# EAGLE design Delta Calc (EAGLE 9.3.0)
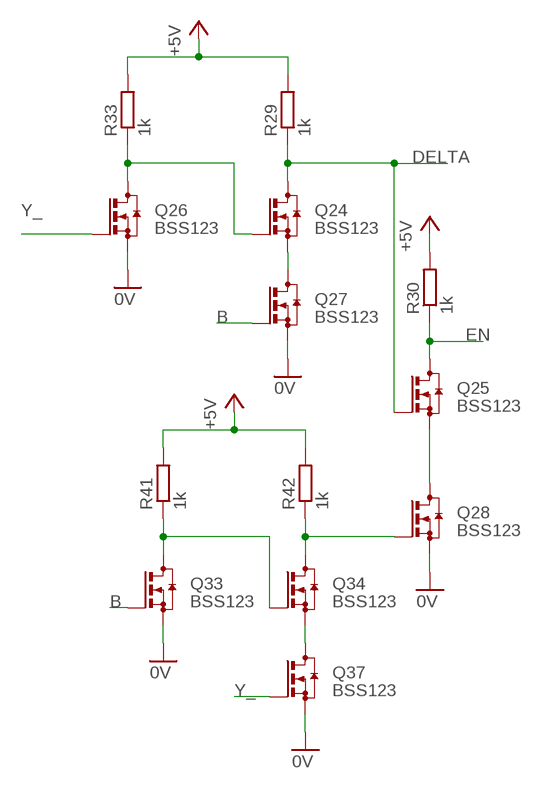
[diagram p0: schematic, sheet 1]

## Parts
Q24  BSS123  [SOT23]
Q25  BSS123  [SOT23]
Q26  BSS123  [SOT23]
Q27  BSS123  [SOT23]
Q28  BSS123  [SOT23]
Q33  BSS123  [SOT23]
Q34  BSS123  [SOT23]
Q37  BSS123  [SOT23]
R29  1k  R-EU_M0805  [M0805]
R30  1k  R-EU_M0805  [M0805]
R33  1k  R-EU_M0805  [M0805]
R41  1k  R-EU_M0805  [M0805]
R42  1k  R-EU_M0805  [M0805]

## Nets
0V: Q26.2(S) Q27.2(S) Q28.2(S) Q33.2(S) Q37.2(S)
+5V: R29.2 R30.2 R33.2 R41.2 R42.2
B: Q27.1(G) Q33.1(G)
DELTA: Q24.3(D) Q25.1(G) R29.1
EN: Q25.3(D) R30.1
N$30: Q24.1(G) Q26.3(D) R33.1
N$32: Q24.2(S) Q27.3(D)
N$36: Q28.1(G) Q34.3(D) R42.1
N$37: Q33.3(D) Q34.1(G) R41.1
N$40: Q25.2(S) Q28.3(D)
N$43: Q34.2(S) Q37.3(D)
Y_: Q26.1(G) Q37.1(G)

## Library data of the parts
Q24-Q28 Q33 Q34 Q37 = transistor-small-signal:BSS123: N-CHANNEL MOS FET
R29 R30 R33 R41 R42 = rcl:R-EU_: RESISTOR, European symbol; SPICEPREFIX: R

## Board
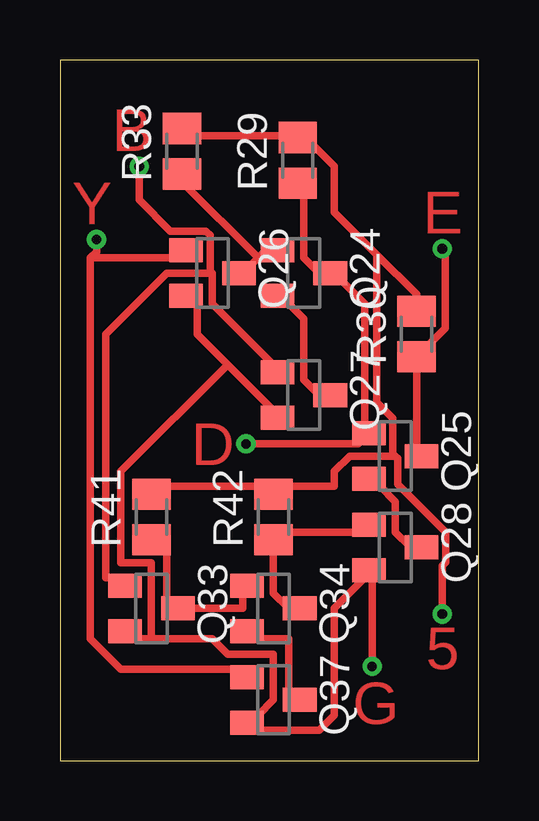
[diagram p1: board, top side]

Size 17.45 x 29.2 mm. Coordinates in mm from the lower left corner, seen from the top.
Outline: 0,0 17.45,0 17.45,29.2 0,29.2 0,0
Copper layers (1*16): Top 0.035mm / dielectric 1.5mm / Bottom 0.035mm
Design rules "default *": minimum track width 12mil, minimum drill 0.35mm, track to track 6mil, track to pad 6mil, pad to pad 6mil, via to via 6mil, smd to smd 6mil, copper to edge 40mil, drill to drill 6mil, minimum pad ring 10mil, minimum via ring 8mil, stop-mask expansion 4mil, vias tented up to drill 0mil, thermal gap 10mil

### Footprints (pad centres in the part's own frame; a part is rotated, then mirrored left to right if it is on the bottom)
SOT23 = smd 1 x 1.4: 1 -0.95,-1.1; 2 0.95,-1.1; 3 0,1.1
M0805 = smd 1.3 x 1.6: 1 -0.95,0; 2 0.95,0

### Placement (x,y rotation side)
Q24  10.16,20.32 270 top
Q25  13.97,12.7 270 top
Q26  6.35,20.32 270 top
Q27  10.16,15.24 270 top
Q28  13.97,8.89 270 top
Q33  3.81,6.35 270 top
Q34  8.89,6.35 270 top
Q37  8.89,2.54 270 top
R29  9.91,25.02 90 top
R30  14.86,17.78 90 top
R33  5.08,25.4 90 top
R41  3.81,10.16 90 top
R42  8.89,10.16 90 top

### Tracks (layer width: path | path; a pad name or v marks a point on that pad's centre or on a via)
0V  (via drill 0.4)
  Top 0.305: 6.99,16.51 5.71,17.78 5.71,19.05 Q26.2 | 6.99,16.51 8.89,14.61 Q27.2 | 3.81,5.08 6.35,5.08 6.99,4.45 8.89,4.45 8.89,2.54 8.26,1.91 Q37.2 8.26,1.27 10.79,1.27 11.43,1.91 11.43,6.35 12.7,7.62 Q28.2 13.01,7.8 v13.01,3.94 | 3.81,5.08 3.17,5.08 Q33.2 | 6.99,16.51 2.54,12.06 2.54,8.26 3.81,8.26 3.81,5.08
+5V  (via drill 0.4)
  Top 0.305: 8.89,11.43 3.81,11.43 R41.2 | R33.2 5.08,26.04 9.53,26.04 R29.2 10.16,26.04 11.43,24.77 11.43,22.86 13.21,21.08 | 13.21,21.08 14.86,19.43 R30.2 | 8.89,11.43 11.43,11.43 11.43,12.06 12.06,12.7 13.97,12.7 | 8.89,11.43 R42.2 | 13.97,12.7 13.88,12.79 13.88,14.28 13.21,14.94 13.21,21.08 | 13.97,12.7 14.06,12.61 14.06,11.53 16.07,9.52 16.07,8.26 15.93,8.12 v15.93,6.12
B  (via drill 0.4)
  Top 0.305: 6.35,20.32 4.45,20.32 1.91,17.78 1.91,7.62 2.54,7.62 Q33.1 | 6.35,20.32 6.35,19.05 8.89,16.51 Q27.1 | 6.35,20.32 6.25,20.41 6.25,21.9 6.08,22.07 4.59,22.07 3.3,23.37 v3.3,24.77
DELTA  (via drill 0.4)
  Top 0.305: R29.1 10.16,23.5 10.16,20.95 10.79,20.32 Q24.3 11.43,20.32 12.7,19.05 12.7,13.97 Q25.1 12.43,13.21 v7.75,13.21
EN  (via drill 0.4)
  Top 0.305: Q25.3 14.86,12.91 R30.1 16.06,18.03 16.06,21.21 v15.93,21.34
N$30
  Top 0.305: 8.26,20.95 8.89,21.59 Q24.1 | 8.26,20.95 7.62,20.32 Q26.3 | 8.26,20.95 5.08,24.13 R33.1
N$32
  Top 0.305: Q27.3 10.79,15.24 10.16,15.88 10.16,18.41 9.53,19.05 Q24.2
N$36
  Top 0.305: Q34.3 9.53,6.35 8.89,6.99 R42.1 8.89,9.53 12.7,9.53 Q28.1
N$37
  Top 0.305: Q34.1 7.62,6.99 7.62,6.35 Q33.3 4.45,6.35 4.45,8.89 3.81,8.89 R41.1
N$40
  Top 0.305: Q28.3 14.61,8.89 13.97,9.53 13.97,10.79 13.34,11.43 Q25.2
N$43
  Top 0.305: Q37.3 9.53,2.54 9.53,5.08 8.26,5.08 Q34.2
Y_  (via drill 0.4)
  Top 0.305: 1.27,20.95 5.08,20.95 Q26.1 | 1.27,20.95 1.27,5.08 2.54,3.81 7.62,3.81 Q37.1 | 1.27,20.95 1.52,21.21 v1.52,21.72

### Text on the board
Top: B | Y | E | D | 5 | G